# Altium schematic sheet Perifericos.SchDoc: Sanhaço - Periféricos
size A4; DocumentNumber: CB04; Revision: 1.1; SheetNumber: 4; SheetTotal: 4; ProjectName: Sanhaço
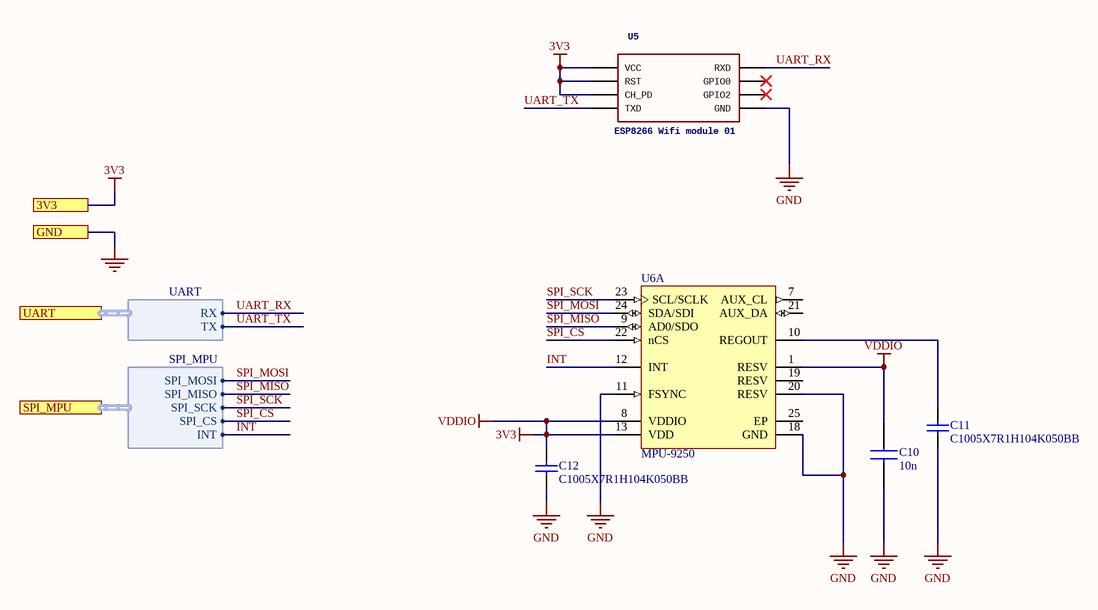
[diagram p0: Perifericos.SchDoc]

## Parts
C10  10n  [CAPC1005X55N]
C11  C1005X7R1H104K050BB  [TDK-C1005-2_M]
C12  C1005X7R1H104K050BB  [TDK-C1005-2_M]
U5  ESP8266 Wifi module 01  [ESP01]
U6  MPU-9250  [INSE-QFN-24-1700X1540TP_L]  (part A of 2)

## Ports
3V3, GND, SPI_MPU (harness SPI_MPU), UART (harness UART)

## Harnesses
UART: RX, TX
SPI_MPU: SPI_MOSI, SPI_MISO, SPI_SCK, SPI_CS, INT

## Nets
0: port GND
3V3: C10.1 C12.2 U5.CH_PD U5.RST U5.VCC U6.1(RESV) U6.8(VDDIO) U6.13(VDD) ; port 3V3  [also labelled VDDIO]
GND: C10.2 C11.1 C12.1 U5.GND U6.11(FSYNC) U6.18(GND) U6.20(RESV)
INT: U6.12(INT) ; port SPI_MPU.INT
SPI_CS: U6.22(nCS) ; port SPI_MPU.SPI_CS
SPI_MISO: U6.9(AD0/SDO) ; port SPI_MPU.SPI_MISO
SPI_MOSI: U6.24(SDA/SDI) ; port SPI_MPU.SPI_MOSI
SPI_SCK: U6.23(SCL/SCLK) ; port SPI_MPU.SPI_SCK
UART_RX: U5.RX(RXD) ; port UART.RX
UART_TX: U5.TX(TXD) ; port UART.TX
NetC11_2: C11.2 U6.10(REGOUT)

Not connected (* = marked no-connect by the designer): U5 GPIO0* GPIO2*; U6 7(AUX_CL) 19(RESV) 21(AUX_DA) 25(EP)

## Notes on the sheet
- Title
- Size:
- Date:
- A4
- Number:
- Time:
- Revision:
- Sheet
- of
- File:

## Library data of the parts
C10 = GRM155R71E103JA01J: Capacitor; Manufacturer_Name: Murata Electronics; Manufacturer 1: Murata; Description: Multilayer Ceramic Capacitors MLCC - SMD/SMT 0402 0.01uF 25volts X7R 5%; Tolerance: 5%; Capacitance: 10nF; Voltage Rating: 25V; Dielectric: X7R; Datasheet Link: http://www.murata.com/~/media/webrenewal/support/library/catalog/products/capacitor/mlcc/c02e.pdf; Height: 0.55mm; Manufacturer_Part_Number: GRM155R71E103JA01J; Mouser Part Number: 81-GRM155R71E103JA1J; Mouser Price/Stock: https://www.mouser.com/Search/Refine.aspx?Keyword=81-GRM155R71E103JA1J; Supplier 1: Digi-Key; Supplier Part Number 1: 490-6340-1-ND; Manufacturer Part Number 1: GRM155R71E103JA01J; Stock 1: 414697; Pricing 1: 1=0,10000, 10=0,03500, 100=0,01580, 500=0,01128, 1000=0,00886, 2500=0,00805, 5000=0,00741 (USD); RoHS: Yes; Mount: Surface Mount; Case/Package: 0402; Case Code (Metric): 1005; Case Code (Imperial): 0402; Min Operating Temperature: -55°C; Max Operating Temperature: 125°C; Packaging: Tape and Reel; Package Quantity: 50000; Voltage Rating (DC): 25V; Termination: SMD/SMT; Length: 1mm; Width: 0.02inch; Thickness: 0.022inch; Depth: 0.5mm; Radiation Hardening: No; Lead Free: Lead Free; ComponentLink1URL: https://datasheet.ciiva.com/5413/product-5413481.pdf?src-supplier=Mouser; ComponentLink1Description: https://datasheet.ciiva.com/5413/product-5413481.pdf?src-supplier=Mouser; ComponentLink2URL: https://datasheet.ciiva.com/6263/partnumbering-e-01-6263653.pdf?src-supplier=Digi-Key; ComponentLink2Description: https://datasheet.ciiva.com/6263/partnumbering-e-01-6263653.pdf?src-supplier=Digi-Key; ComponentLink3URL: https://datasheet.ciiva.com/6263/partnumbering-e-01-6263656.pdf?src-supplier=Digi-Key; ComponentLink3Description: https://datasheet.ciiva.com/6263/partnumbering-e-01-6263656.pdf?src-supplier=Digi-Key; ComponentLink4URL: https://datasheet.ciiva.com/6263/partnumbering-e-01-6263659.pdf?src-supplier=Digi-Key; ComponentLink4Description: https://datasheet.ciiva.com/6263/partnumbering-e-01-6263659.pdf?src-supplier=Digi-Key; ComponentLink5URL: https://datasheet.ciiva.com/11619/c02e-11619963.pdf?src-supplier=Avnet; ComponentLink5Description: https://datasheet.ciiva.com/11619/c02e-11619963.pdf?src-supplier=Avnet
C11 C12 = CMP-2000-05393-1: Chip Capacitor, 0.1 uF, +/- 10%, 50 V, -55 to 125 degC, 0402(1005 Metric), RoHS, Tape and Reel; PCN Part Number: MLCCPartNumberChange30/Nov/2012; Manufacturer: TDK; Product Training Modules: CSeriesGeneralApplicationsSEAT,CCV,andTVCLDesignToolsGuidetoReplacinganElectrolyticCapacitorwithanMLCC; Other Names: 445-5932-1; Kits: 445-9021-KIT-ND-KITMLCC100PF-10UF04026.3-50V445-9003-KIT-ND-KITCAPCERHICAPMLCCSMD; Voltage - Rated: 50V; Temperature Coefficient: X7R; Capacitance: 0.1µF; Online Catalog: CSeries,GeneralPurpose; Manufacturer URL: http://www.tdk.com/; Category: Capacitors; Mounting Type: SurfaceMount,MLCC; Datasheet Version: Mar-15; Datasheet URL: http://www.farnell.com/datasheets/1913358.pdf; Packaging: CutTape(CT); Standard Package: 1; Features: -; Operating Temperature: -55degC~125degC; Tolerance: ±10%; RoHS Information: RoHSCertificate-MLCC; Applications: GeneralPurpose; Lead Style: -; Ratings: -; Height - Seated (Max): -; Lead Spacing: -; Package / Case: 0402(1005Metric); Series: C; Family: CeramicCapacitors
U5 = ESP01: ESP-01; GateName_1: G$1; SymbolName_1: ESP01; LibraryName: esp8266modules; DeviceSetName: ESP01; Package: ESP01
U6 = CMP-2100-03657-1: 9-axis MotionTracking device, 2.4 to 3,6 V, -40 to 85 degC, 24-Pin QFN, RoHS, Tape and Reel; Manufacturer: InvenSense; Max Supply Voltage: 3.6V; Min Supply Voltage: 2.4V; Package Reference: QFN-24; Package Quantity: 1; Datasheet Version: Rev. 1.0, 01/2014; Case/Package: QFN; Package Description: 24-Pin Quad Flat No-lead Package, Body 3 x 3 mm, Pitch 0.4 mm; Datasheet URL: http://datasheet.octopart.com/MPU-9250-InvenSense-datasheet-21859386.pdf; RoHSCompliant: true; Max Operating Temperature: 85degC; Height: 1mm; Mount: SurfaceMount; Manufacturer URL: http://www.invensense.com/; Width: 3.1mm; Min Operating Temperature: -40degC; Length: 3.1mm